# EAGLE design avr_programmer_v2 (EAGLE 5.06)
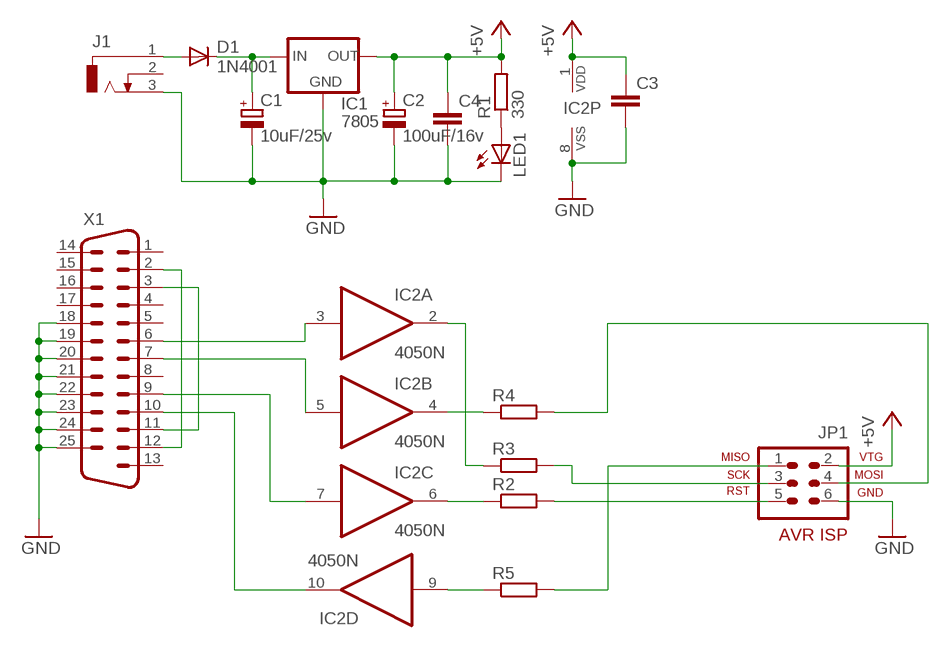
[diagram p0: schematic, sheet 1]

## Parts
C1  10uF/25v  CPOL-EUE2.5-6  [E2,5-6]
C2  100uF/16v  CPOL-EUE2.5-6  [E2,5-6]
C3  C-EU050-025X075  [C050-025X075]
C4  C-EU025-025X050  [C025-025X050]
D1  1N4001  1N4004B  [D-2.5]
IC1  7805  78XXS  [78XXS]
IC2  4050N  [DIL16]
J1  DCJ0202  [DCJ0202A]
JP1  AVR-ISP-6  [AVR-ISP-6]
LED1  LED5MM  [LED5MM]
R1  330  R-EU_  [0207/7]
R2  R-EU_  [0207/7]
R3  R-EU_  [0207/7]
R4  R-EU_  [0207/7]
R5  R-EU_  [0207/7]
X1  M25HP  [M25HP]

## Nets
+5V: C2.+ C3.1 C4.1 IC1.OUT IC2.1(P:VDD) JP1.2(VTG) R1.2
GND: C1.- C2.- C3.2 C4.2 IC1.GND IC2.8(P:VSS) J1.3 JP1.6(GND) LED1.K(C) X1.18 X1.19 X1.20 X1.21 X1.22 X1.23 X1.24 X1.25
MISO: JP1.1(MISO) R5.2
MOSI: JP1.4(MOSI) R4.2
N$1: LED1.A R1.1
N$2: IC2.3(A:I) X1.6
N$3: IC2.6(C:O) R2.1
N$4: IC2.5(B:I) X1.7
N$5: JP1.5(RST) R2.2
N$6: IC2.7(C:I) X1.9
N$7: IC2.2(A:O) R3.1
N$8: IC2.10(D:O) X1.10
N$9: IC2.4(B:O) R4.1
N$10: IC2.9(D:I) R5.1
N$11: D1.A J1.1
N$12: X1.2 X1.12
N$13: X1.3 X1.11
N$14: C1.+ D1.C IC1.IN
SCK: JP1.3(SCK) R3.2
Unconnected: IC2.11(E:I) IC2.12(E:O) IC2.14(F:I) IC2.15(F:O) J1.2 X1.1 X1.4 X1.5 X1.8 X1.13 X1.14 X1.15 X1.16 X1.17 X1.G1 X1.G2

## Library data of the parts
C1 C2 = gravador_avr:CPOL-EU: POLARIZED CAPACITOR, European symbol
C3 C4 = gravador_avr:C-EU: CAPACITOR, European symbol
D1 = gravador_avr:1N4004: DIODE general purpose rectifier, 1 A
IC1 = gravador_avr:78XXS: VOLTAGE REGULATOR
IC2 = gravador_avr:4050: Hex non-inverting BUFFER
J1 = gravador_avr:DCJ0202: DC POWER JACK Source: DCJ0202.pdf
JP1 = gravador_avr:AVR-ISP-6: AVR ISP-6 Serial Programming Header
LED1 = gravador_avr:LED: LED OSRAM: - CHIPLED LG R971, LG N971, LY N971, LG Q971, LY Q971, LO R971, LY R971 LH N974, LH R974 LS Q976, LO Q976, LY Q976 LO Q996 - Hyper CHIPLED LW Q18S LB Q993, LB Q99A, LB R99A - SideLED LS A670, LO A670, LY A670, LG A670, LP A670 LB A673, LV A673, LT A673, LW A673 LH A674 LY A675 LS A676, LA A676, LO A676, LY A676, LW A676 LS A679, LY A679, LG A679 - Hyper Micro SIDELED® LS Y876, LA Y876, LO Y876, LY Y876 LT Y87S - SmartLED LW L88C, LW L88S LB L89C, LB L89S, LG L890 LS L89K, LO L89K, LY L89K LS L896, LA L896, LO L896, LY L896 - TOPLED LS T670, LO T670, LY T670, LG T670, LP T670 LSG T670, LSP T670, LSY T670, LOP T670, LYG T670 LG T671, LOG T671, LSG T671 LB T673, LV T673, LT T673, LW T673 LH T674 LS T676, LA T676, LO T676, LY T676, LB T676, LH T676, LSB T676, LW T676 LB T67C, LV T67C, LT T67C, LS T67K, LO T67K, LY T67K, LW E67C LS E67B, LA E67B, LO E67B, LY E67B, LB E67C, LV E67C, LT E67C LW T67C LS T679, LY T679, LG T679 LS T770, LO T770, LY T770, LG T770, LP T770 LB T773, LV T773, LT T773, LW T773 LH T774 LS E675, LA E675, LY E675, LS T675 LS T776, LA T776, LO T776, LY T776, LB T776 LHGB T686 LT T68C, LB T68C - Hyper Mini TOPLED® LB M676 - Mini TOPLED Santana® LG M470 LS M47K, LO M47K, LY M47K Source: http://www.osram.convergy.de - LUMILED® LXK2-PW12-R00, LXK2-PW12-S00, LXK2-PW14-U00, LXK2-PW14-V00 LXK2-PM12-R00, LXK2-PM12-S00, LXK2-PM14-U00 LXK2-PE12-Q00, LXK2-PE12-R00, LXK2-PE12-S00, LXK2-PE14-T00, LXK2-PE14-U00 LXK2-PB12-K00, LXK2-PB12-L00, LXK2-PB12-M00, LXK2-PB14-N00, LXK2-PB14-P00, LXK2-PB14-Q00 LXK2-PR12-L00, LXK2-PR12-M00, LXK2-PR14-Q00, LXK2-PR14-R00 LXK2-PD12-Q00, LXK2-PD12-R00, LXK2-PD12-S00 LXK2-PH12-R00, LXK2-PH12-S00 LXK2-PL12-P00, LXK2-PL12-Q00, LXK2-PL12-R00 Source: www.luxeon.com
R1-R5 = gravador_avr:R-EU_: RESISTOR, European symbol
X1 = gravador_avr:M25HP: SUB-D

## Board
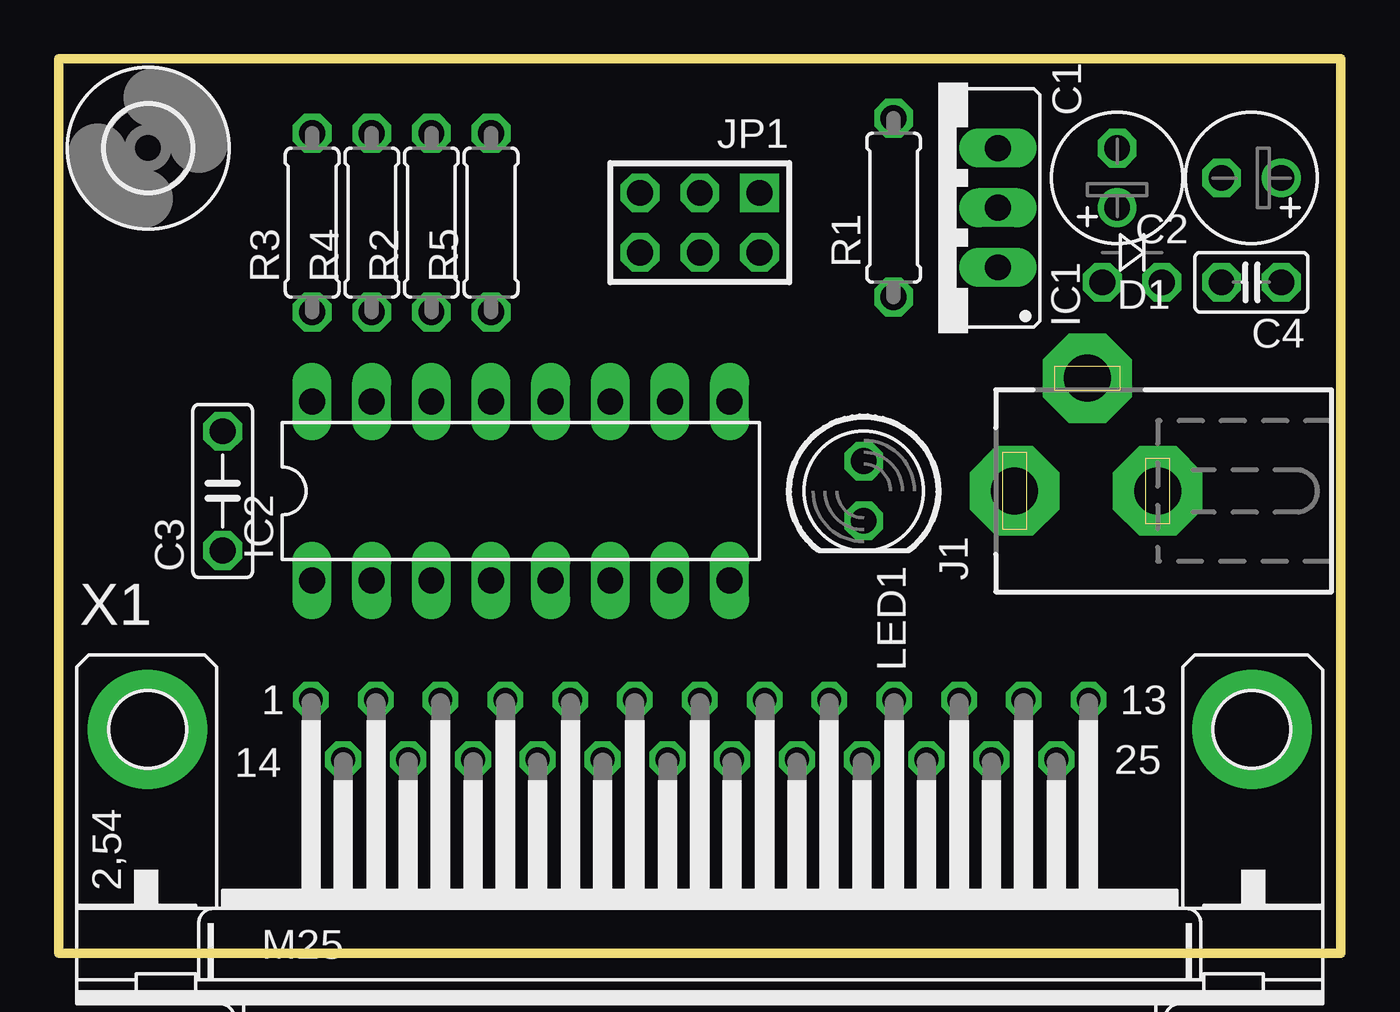
[diagram p1: board, top side]
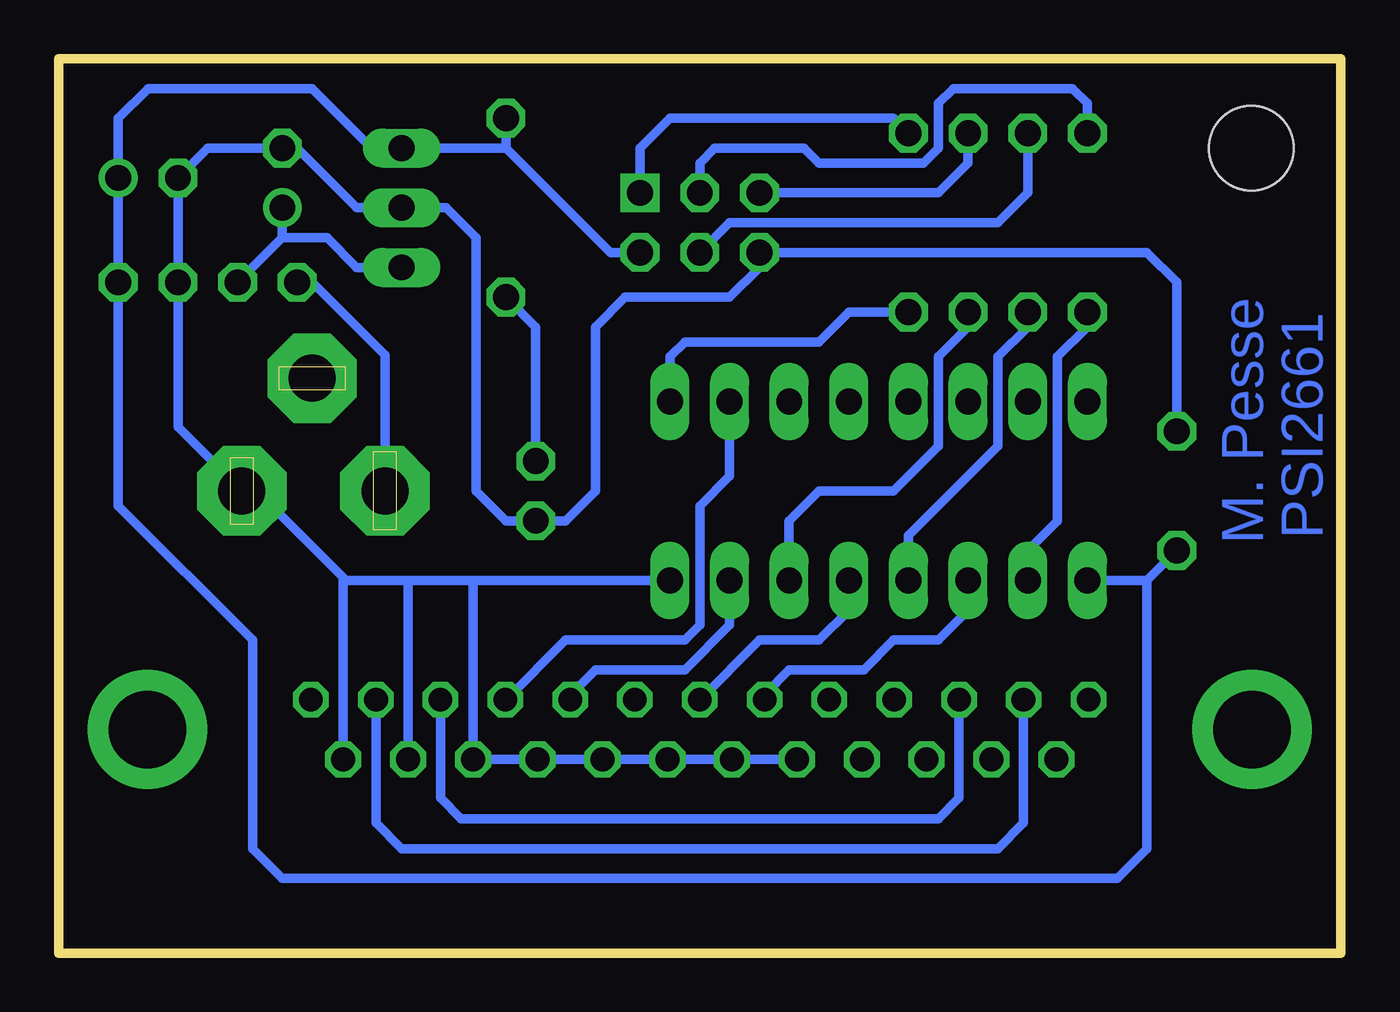
[diagram p2: board, bottom side, seen from below]

Size 54.61 x 38.1 mm. Coordinates in mm from the lower left corner, seen from the top.
Outline: 0,0 54.61,0 54.61,38.1 0,38.1 0,0
Copper layers (1*16): Top 0.035mm / dielectric 1.5mm / Bottom 0.035mm
Design rules "default": minimum track width 10mil, minimum drill 24mil, track to track 8mil, track to pad 8mil, pad to pad 8mil, via to via 8mil, smd to smd 8mil, copper to edge 40mil, drill to drill 8mil, minimum pad ring 10mil, minimum via ring 8mil, stop-mask expansion 4mil, vias tented up to drill 0mil, thermal gap 10mil

### Footprints (pad centres in the part's own frame; a part is rotated, then mirrored left to right if it is on the bottom)
E2,5-6 = drill 1.1 round: + -1.27,0 | drill 1.1 pad 1.6 octagon: - 1.27,0
C050-025X075 = drill 1.1 octagon: 1 -2.54,0; 2 2.54,0
C025-025X050 = drill 1.1 octagon: 1 -1.27,0; 2 1.27,0
D-2.5 = drill 1.1 octagon: A 1.27,1.27; C -1.27,1.27
78XXS = drill 1.1 long: GND 0,-2.54; IN -2.54,-2.54; OUT 2.54,-2.54
DIL16 = drill 1.1 long: 1 -8.89,-3.81; 2 -6.35,-3.81; 3 -3.81,-3.81; 4 -1.27,-3.81; 5 1.27,-3.81; 6 3.81,-3.81; 7 6.35,-3.81; 8 8.89,-3.81; 9 8.89,3.81; 10 6.35,3.81; 11 3.81,3.81; 12 1.27,3.81; 13 -1.27,3.81; 14 -3.81,3.81; 15 -6.35,3.81; 16 -8.89,3.81
DCJ0202A = drill 2 pad 3.81 octagon: 1 0,3.1; 2 4.8,0; 3 0,-3
AVR-ISP-6 = drill 1.1 square: 1 -2.54,-1.27 | drill 1.1 octagon: 2 -2.54,1.27; 3 0,-1.27; 4 0,1.27; 5 2.54,-1.27; 6 2.54,1.27
LED5MM = drill 1.1 octagon: A -1.27,0; K 1.27,0
0207/7 = drill 1.1 octagon: 1 -3.81,0; 2 3.81,0
3,6 = hole 3.6: 0,0
M25HP = drill 1.016 octagon: 1 -16.561,1.27; 2 -13.792,1.27; 3 -11.049,1.27; 4 -8.28,1.27; 5 -5.512,1.27; 6 -2.769,1.27; 7 0,1.27; 8 2.769,1.27; 9 5.512,1.27; 10 8.28,1.27; 11 11.049,1.27; 12 13.792,1.27; 13 16.561,1.27; 14 -15.189,-1.27; 15 -12.421,-1.27; 16 -9.652,-1.27; 17 -6.909,-1.27; 18 -4.14,-1.27; 19 -1.372,-1.27; 20 1.372,-1.27; 21 4.14,-1.27; 22 6.909,-1.27; 23 9.652,-1.27; 24 12.421,-1.27; 25 15.189,-1.27 | drill 3.302 pad 5.08 round: G1 -23.52,0; G2 23.52,0

### Placement (x,y rotation side)
C1  45.09,33.02 90 top
C2  50.8,33.02 180 top
C3  6.99,19.68 90 top
C4  50.8,28.57 180 top
D1  45.72,29.84 180 top
IC1  37.47,31.75 90 top
IC2  19.68,19.68 0 top
J1  43.81,19.68 90 top
JP1  27.3,31.11 180 top
LED1  34.29,19.68 270 top
R1  35.56,31.75 90 top
R2  15.88,31.11 90 top
R3  10.79,31.11 90 top
R4  13.34,31.11 90 top
R5  18.41,31.11 90 top
U$1  [3,6]  3.81,34.29 0 top
X1  27.3,9.53 0 top

### Tracks (layer width: path | path; a pad name or v marks a point on that pad's centre or on a via)
+5V
  Bottom 0.406: 8.26,15.88 C3.1 | 35.56,34.29 R1.2 | JP1.2 31.11,29.84 35.56,34.29 | 8.26,15.88 IC2.1 | 8.26,15.88 8.26,4.45 9.53,3.17 45.09,3.17 46.35,4.45 46.35,13.34 52.07,19.05 C4.1 C2.+ 52.07,35.56 50.8,36.83 43.81,36.83 41.27,34.29 IC1.OUT 35.56,34.29
GND
  Bottom 0.406: X1.18 X1.19 X1.20 X1.21 X1.22 X1.23 36.96,15.88 36.83,15.88 | C3.2 6.99,28.57 8.26,29.84 JP1.6 24.77,29.21 26.04,27.94 30.48,27.94 31.75,26.67 31.75,19.68 33.02,18.41 LED1.K 35.56,18.41 36.83,19.68 36.83,30.48 38.1,31.75 IC1.GND 41.91,31.75 44.45,34.29 C1.- 48.26,34.29 C2.- C4.2 49.53,22.4 J1.3 46.18,19.68 42.37,15.88 41.91,15.88 | 41.91,15.88 39.37,15.88 | 39.37,15.88 36.83,15.88 | 36.83,15.88 IC2.8 | X1.24 39.73,15.88 39.37,15.88 | X1.25 42.49,15.88 41.91,15.88
MISO
  Bottom 0.406: R5.2 19.05,35.56 28.57,35.56 29.84,34.29 JP1.1
MOSI
  Bottom 0.406: R4.2 13.34,32.38 14.61,31.11 26.04,31.11 JP1.4
N$1
  Bottom 0.406: LED1.A 34.29,26.67 R1.1
N$2
  Bottom 0.406: X1.6 24.54,11.02 23.5,12.06 20.32,12.06 19.05,13.34 17.14,13.34 15.88,14.61 IC2.3
N$3
  Bottom 0.406: R2.1 15.88,26.67 17.14,25.4 17.14,21.59 19.05,19.68 22.23,19.68 23.5,18.41 IC2.6
N$4
  Bottom 0.254: X1.7 27.43,10.67
  Bottom 0.406: X1.7 24.77,13.34 22.23,13.34 20.95,14.61 IC2.5
N$5
  Bottom 0.406: JP1.5 17.14,32.38 15.88,33.66 R2.2
N$6
  Bottom 0.406: IC2.7 26.04,13.97 27.94,12.06 31.75,12.06 32.82,11 X1.9
N$7
  Bottom 0.406: IC2.2 13.34,17.14 12.06,18.41 12.06,25.4 10.79,26.67 R3.1
N$8
  Bottom 0.406: X1.10 35.56,10.79 33.02,13.34 27.94,13.34 27.3,13.97 27.3,19.05 26.04,20.32 IC2.10
N$9
  Bottom 0.406: IC2.4 18.41,17.78 14.61,21.59 14.61,25.4 13.34,26.67 R4.1
N$10
  Bottom 0.406: IC2.9 28.57,25.4 27.94,26.04 22.23,26.04 20.95,27.3 R5.1
N$11
  Bottom 0.406: J1.1 40.72,25.48 43.81,28.57 D1.A
N$12
  Bottom 0.406: X1.12 41.1,5.54 40.01,4.45 14.61,4.45 13.51,5.54 X1.2
N$13
  Bottom 0.406: X1.3 16.26,6.6 17.14,5.71 37.47,5.71 38.35,6.6 X1.11
N$14
  Bottom 0.406: 45.09,30.48 C1.+ | 45.09,30.48 D1.C | IC1.IN 41.91,29.21 43.18,30.48 45.09,30.48
SCK
  Bottom 0.406: R3.2 10.79,36.2 11.43,36.83 16.51,36.83 17.14,36.2 17.14,34.29 17.78,33.66 22.23,33.66 22.86,34.29 26.67,34.29 27.3,33.66 JP1.3

### Text on the board
Bottom: M. Pesse | PSI2661